# EAGLE design marc_rfid (EAGLE 5.06)
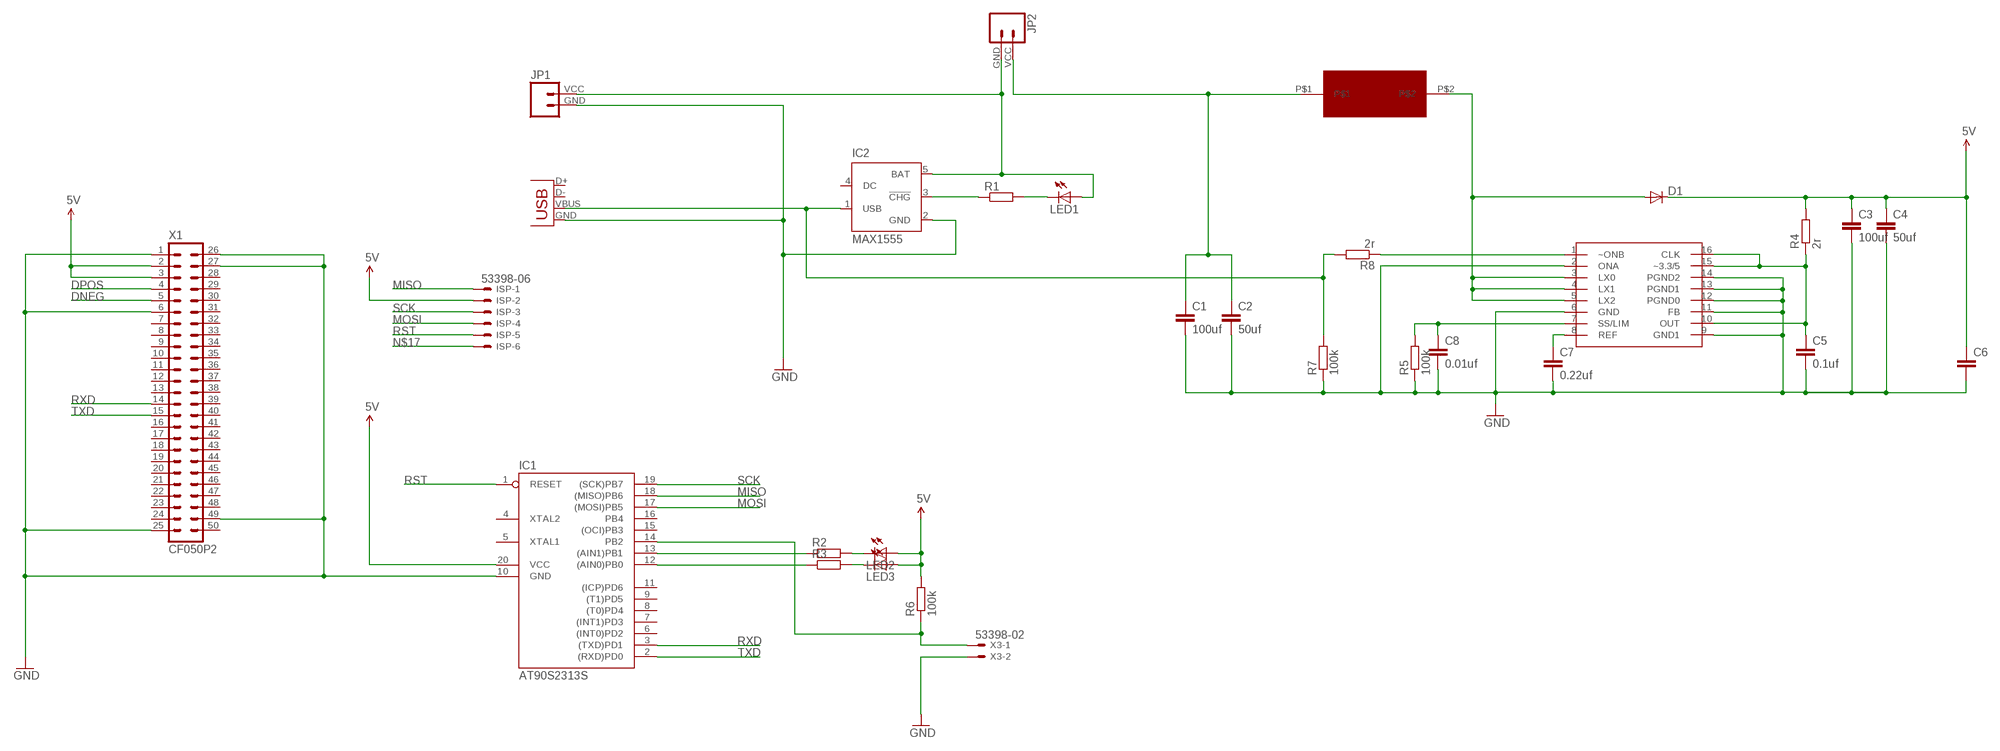
[diagram p0: schematic, sheet 1]

## Parts
C1  100uf  C-EUC1210  [C1210]
C2  50uf  C-EUC1210  [C1210]
C3  100uf  C-EUC1210  [C1210]
C4  50uf  C-EUC1210  [C1210]
C5  0.1uf  C-EUC0805  [C0805]
C6  C-EUC0805  [C0805]
C7  0.22uf  C-EUC0805  [C0805]
C8  0.01uf  C-EUC0805  [C0805]
D1  DIODE-DO214AC  [DO214AC]
IC1  AT90S2313S  [SO20L]
IC2  MAX1555  [SOT23-5L]
ISP  53398-06  [53398-06]
JP1  M024UCON-15767  [S2B-PH-VERTICAL]
JP2  M024UCON-15767  [S2B-PH-VERTICAL]
LED1  LED1206  [LED-1206]
LED2  LED1206  [LED-1206]
LED3  LED1206  [LED-1206]
R1  R-EU_R0805  [R0805]
R2  R-EU_R0805  [R0805]
R3  R-EU_R0805  [R0805]
R4  2r  R-EU_R0805W  [R0805W]
R5  100k  R-EU_R0805W  [R0805W]
R6  100k  R-EU_R0805W  [R0805W]
R7  100k  R-EU_R0805W  [R0805W]
R8  2r  R-EU_R0805W  [R0805W]
U$5  MAX1708  [QSOP16]
U$6  WE-TPC8015  [WE-TPC8015]
X1  CF050P2  [CF050P2]
X2  USBSMD  [USB-MINIB]
X3  53398-02  [53398-02]

## Nets
5V: C3.1 C4.1 C6.1 D1.C IC1.20(VCC) ISP.2 LED2.A LED3.A R4.2 R6.2 X1.2 X1.3
DNEG: X1.5
DPOS: X1.4
MISO: IC1.18((MISO)PB6) ISP.1
MOSI: IC1.17((MOSI)PB5) ISP.4
N$1: C1.1 C2.1 JP2.VCC U$6.P$1
N$2: IC1.13((AIN1)PB1) R2.1
N$3: IC2.1(USB) R7.2 R8.2 X2.VBUS
N$4: IC2.3(!CHG) R1.1
N$5: LED1.C R1.2
N$6: IC1.12((AIN0)PB0) R3.1
N$7: LED2.C R2.2
N$8: LED3.C R3.2
N$9: D1.A U$5.3(LX0) U$5.4(LX1) U$5.5(LX2) U$6.P$2
N$10: C7.1 U$5.8(REF)
N$11: C5.1 R4.1 U$5.10(OUT) U$5.15(~3.3/5) U$5.16(CLK)
N$12: C8.1 R5.2 U$5.7(SS/LIM)
N$14: R8.1 U$5.1(~ONB)
N$15: IC1.14(PB2) R6.1 X3.1
N$16: IC2.5(BAT) JP1.VCC JP2.GND LED1.A
N$17: C1.2 C2.2 C3.2 C4.2 C5.2 C6.2 C7.2 C8.2 IC1.10(GND) IC2.2(GND) ISP.6 JP1.GND R5.1 R7.1 U$5.2(ONA) U$5.6(GND) U$5.9(GND1) U$5.11(FB) U$5.12(PGND0) U$5.13(PGND1) U$5.14(PGND2) X1.1 X1.6 X1.25 X1.26 X1.27 X1.49 X2.GND X3.2 ; supply symbol labelled GND
RST: IC1.1(RESET) ISP.5
RXD: IC1.3((TXD)PD1) X1.14
SCK: IC1.19((SCK)PB7) ISP.3
TXD: IC1.2((RXD)PD0) X1.15
Unconnected: IC1.4(XTAL2) IC1.5(XTAL1) IC1.6((INT0)PD2) IC1.7((INT1)PD3) IC1.8((T0)PD4) IC1.9((T1)PD5) IC1.11((ICP)PD6) IC1.15((OCI)PB3) IC1.16(PB4) IC2.4(DC) X1.7 X1.8 X1.9 X1.10 X1.11 X1.12 X1.13 X1.16 X1.17 X1.18 X1.19 X1.20 X1.21 X1.22 X1.23 X1.24 X1.28 X1.29 X1.30 X1.31 X1.32 X1.33 X1.34 X1.35 X1.36 X1.37 X1.38 X1.39 X1.40 X1.41 X1.42 X1.43 X1.44 X1.45 X1.46 X1.47 X1.48 X1.50 X2.D+ X2.D-

## Library data of the parts
C1-C8 = resistor:C-EU: CAPACITOR, European symbol
D1 = diode:DIODE-: DIODE
IC1 = avr-4:AT90S2313: MICROCONTROLLER 2 Kbytes FLASH 128 bytes SRAM 128 bytes EEPROM UART
IC2 = maxim:MAX1555: Dual-Input USB/AC Adapter 1-Cell Li+ Battery Chargers Source: http://www.maxim-ic.com .. MAX1551-MAX1555.pdf
ISP = con-molex:53?-06: CONNECTOR wire to board 1.25 mm (.049 inch) pitch header
JP1 JP2 = SparkFun2:M02: Header 2 Standard 2-pin 0.1" header. Use with straight break away headers (SKU : PRT-00116), right angle break away headers (PRT-00553), swiss pins (PRT-00743), machine pins (PRT-00117), and female headers (PRT-00115). Molex polarized connector foot print use with SKU : PRT-08233 with associated crimp pins and housings.
LED1-LED3 = SparkFun:LED: LEDs Standard schematic elements and footprints for 5mm, 3mm, 1206, and 0603 sized LEDs. 5mm - Spark Fun Electronics SKU : COM-00529 (and others)
R1-R8 = resistor:R-EU_: RESISTOR, European symbol
U$5 = stan_1:MAX1708
U$6 = stan_1:WE-TPC8015
X1 = con-yamaichi-cf:CF050P2: Compact Flash Card Reader, Type I and II CF 050 P2 - * 03 - * 0 - DS
X2 = SparkFun:USB: USB Connectors USB-B-PTH is fully proven SKU : PRT-00139 USB-miniB is fully proven SKU : PRT-00587 USB-A-PCB is untested. USB-A-H is throughly reviewed, but untested. Spark Fun Electronics SKU : PRT-00437 USB-B-SMT is throughly reviewed, but untested. Needs silkscreen touching up. USB-A-S has not been used/tested USB-MB-H has not been used/tested
X3 = con-molex:53?-02: CONNECTOR wire to board 1.25 mm (.049 inch) pitch header

## Board
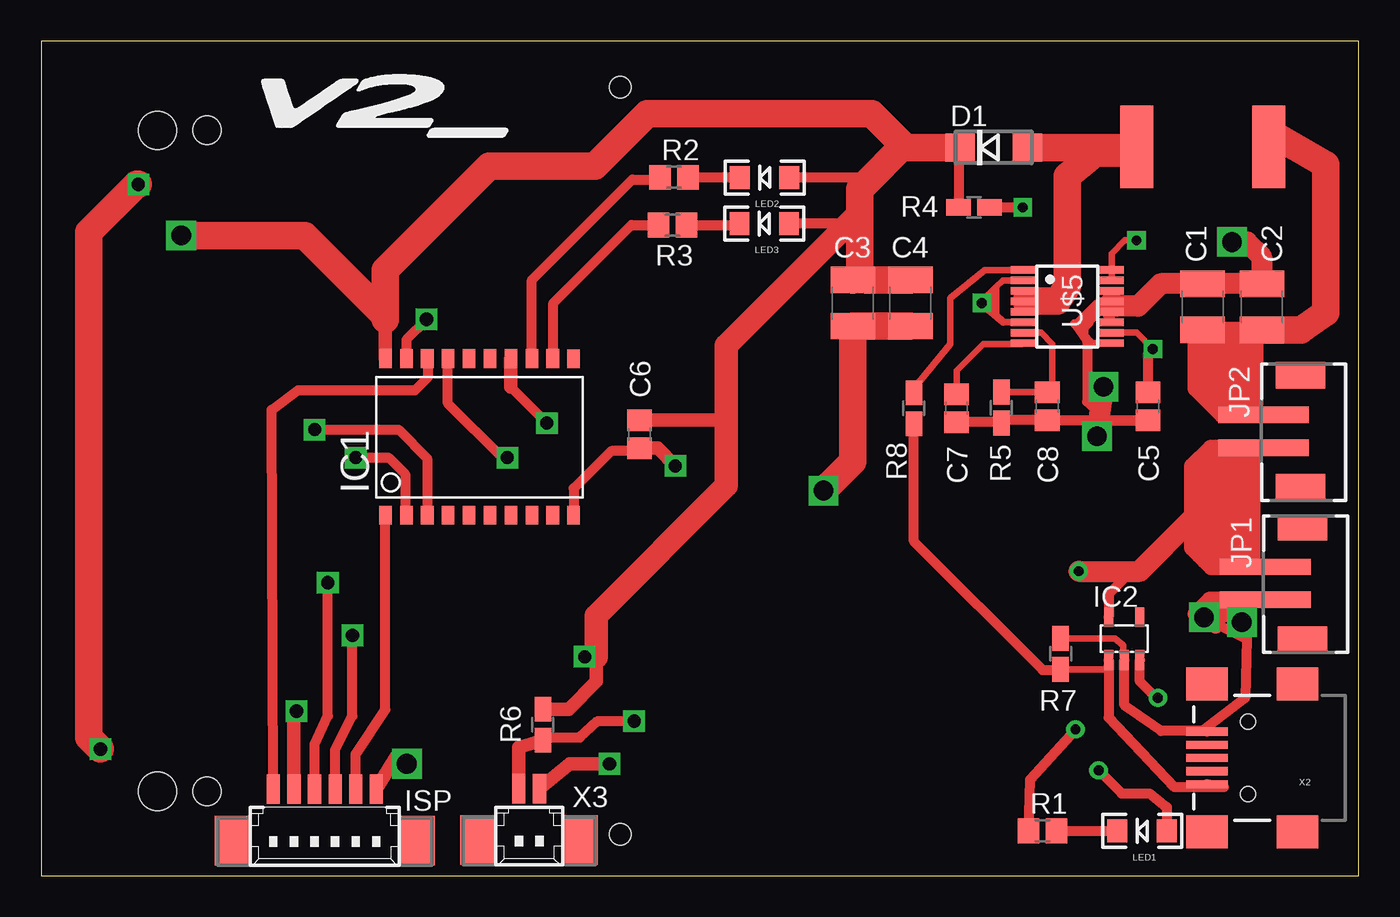
[diagram p1: board, top side]
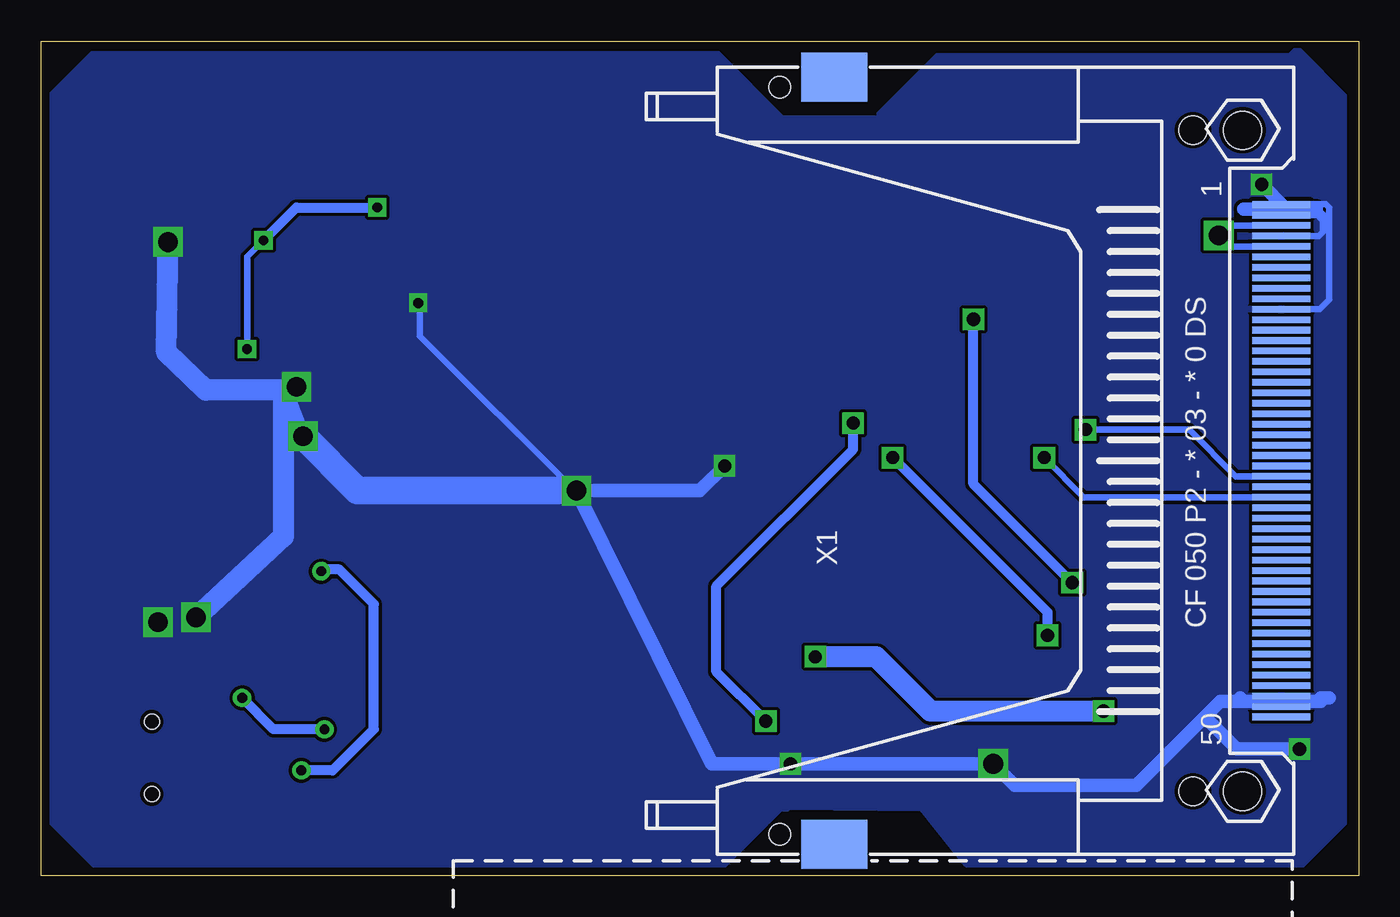
[diagram p2: board, bottom side, seen from below]

Size 80 x 50.7 mm. Coordinates in mm from the lower left corner, seen from the top.
Outline: 0,0 80,0 80,50.7 0,50.7 0,0
Copper layers (1*16): Top 0.035mm / dielectric 1.5mm / Bottom 0.035mm
Design rules "V2_stan *": minimum track width 8mil, minimum drill 20mil, track to track 8mil, track to pad 8mil, pad to pad 6mil, via to via 8mil, smd to smd 0mil, copper to edge 10mil, drill to drill 8mil, minimum pad ring 12mil, minimum via ring 10mil, stop-mask expansion 4mil, vias tented up to drill 25mil, thermal gap 10mil

### Footprints (pad centres in the part's own frame; a part is rotated, then mirrored left to right if it is on the bottom)
C1210 = smd 1.6 x 2.7: 1 -1.4,0; 2 1.4,0
C0805 = smd 1.3 x 1.5: 1 -0.85,0; 2 0.85,0
DO214AC = smd 1.8 x 1.7: A 2.05,0; C -2.05,0
SO20L = smd 0.762 x 1.143: 1 -5.08,-5.131; 2 -3.81,-5.131; 3 -2.54,-5.131; 4 -1.27,-5.131; 5 0,-5.131; 6 1.27,-5.131; 7 2.54,-5.131; 8 3.81,-5.131; 9 5.08,-5.131; 10 6.35,-5.131; 11 6.35,4.369; 12 5.08,4.394; 13 3.81,4.394; 14 2.54,4.394; 15 1.27,4.394; 16 0,4.394; 17 -1.27,4.394; 18 -2.54,4.394; 19 -3.81,4.394; 20 -5.08,4.394
SOT23-5L = smd 0.55 x 1.2: 1 -0.95,-1.3; 2 0,-1.3; 3 0.95,-1.3; 4 0.95,1.3; 5 -0.95,1.3
53398-06 = smd 0.8 x 1.8: 1 3.125,-2.5; 2 1.875,-2.5; 3 0.625,-2.5; 4 -0.625,-2.5; 5 -1.875,-2.5; 6 -3.125,-2.5 | smd 2.1 x 3: S1 5.625,0.625; S2 -5.625,0.625
S2B-PH-VERTICAL = smd 1 x 5.5: GND 1,-2; VCC -1,-2 | smd 1.6 x 3: P$1 -3.4,0.27; P$2 3.4,0.27
LED-1206 = smd 1.2 x 1.4: A -1.5,0; C 1.5,0
R0805 = smd 1.3 x 1.5: 1 -0.85,0; 2 0.85,0
R0805W = smd 1.5 x 1: 1 -0.94,0; 2 0.94,0
QSOP16 = smd 0.45 x 1.5: 1 -2.223,-2.69; 2 -1.587,-2.69; 3 -0.953,-2.69; 4 -0.318,-2.69; 5 0.318,-2.69; 6 0.953,-2.69; 7 1.587,-2.69; 8 2.223,-2.69; 9 2.223,2.69; 10 1.587,2.69; 11 0.953,2.69; 12 0.318,2.69; 13 -0.318,2.69; 14 -0.953,2.69; 15 -1.587,2.69; 16 -2.223,2.69
WE-TPC8015 = smd 5 x 2: P$1 0,-4; P$2 0,4
CF050P2 = smd 0.4 x 3.5: 1 15.557,-5.35; 2 14.287,-5.35; 3 13.018,-5.35; 4 11.748,-5.35; 5 10.477,-5.35; 6 9.207,-5.35; 7 7.938,-5.35; 8 6.668,-5.35; 9 5.397,-5.35; 10 4.128,-5.35; 11 2.857,-5.35; 12 1.587,-5.35; 13 0.318,-5.35; 14 -0.953,-5.35; 15 -2.223,-5.35; 16 -3.493,-5.35; 17 -4.763,-5.35; 18 -6.032,-5.35; 19 -7.303,-5.35; 20 -8.572,-5.35; 21 -9.842,-5.35; 22 -11.113,-5.35; 23 -12.383,-5.35; 24 -13.652,-5.35; 25 -14.922,-5.35; 26 14.922,-5.35; 27 13.652,-5.35; 28 12.383,-5.35; 29 11.113,-5.35; 30 9.842,-5.35; 31 8.572,-5.35; 32 7.303,-5.35; 33 6.032,-5.35; 34 4.763,-5.35; 35 3.493,-5.35; 36 2.223,-5.35; 37 0.953,-5.35; 38 -0.318,-5.35; 39 -1.587,-5.35; 40 -2.857,-5.35; 41 -4.128,-5.35; 42 -5.397,-5.35; 43 -6.668,-5.35; 44 -7.938,-5.35; 45 -9.207,-5.35; 46 -10.477,-5.35; 47 -11.748,-5.35; 48 -13.018,-5.35; 49 -14.287,-5.35; 50 -15.557,-5.35 | smd 3 x 4: P$1 23.3,21.8; P$3 -23.3,21.8 | hole 1.7: -20.08,0; 20.08,0 | hole 2.3: -20.08,-3; 20.08,-3 | hole 1.3: 22.7,25.1; -22.7,25.1
USB-MINIB = smd 2.5 x 0.5: D+ 2.5,0; D- 2.5,0.8; GND 2.5,-1.6; ID 2.5,-0.8; VBUS 2.5,1.6 | smd 2.5 x 2: GND@1 -3,-4.5; GND@2 -3,4.5; GND@3 2.5,4.5; GND@4 2.5,-4.5 | hole 0.9: 0,2.2; 0,-2.2
53398-02 = smd 0.8 x 1.8: 1 0.625,-2.5; 2 -0.625,-2.5 | smd 2.1 x 3: S1 3.125,0.625; S2 -3.125,0.625

### Placement (x,y rotation side)
C1  70.52,34.56 90 top
C2  74.12,34.56 90 top
C3  49.28,34.79 270 top
C4  52.78,34.79 270 top
C5  67.2,28.51 270 top
C6  36.33,26.82 270 top
C7  55.58,28.41 270 top
C8  61.08,28.53 270 top
D1  57.83,44.23 0 top
IC1  25.98,27.03 0 top
IC2  65.76,14.41 0 top
ISP  17.22,2.77 180 top
JP1  76.32,17.76 270 top
JP2  76.2,27 270 top
LED1  66.84,2.72 180 top
LED2  43.92,42.42 180 top
LED3  43.9,39.62 180 top
R1  60.8,2.73 0 top
R2  38.42,42.43 0 top
R3  38.34,39.53 0 top
R4  56.64,40.6 180 top
R5  58.3,28.44 90 top
R6  30.46,9.18 90 top
R7  61.89,13.48 270 top
R8  52.99,28.4 270 top
U$5  62.3,34.58 270 top
U$6  70.52,44.28 90 top
U$8  [V2_LOGO_L]  12.9,44.6 0 top
X1  10.06,25.21 90 bottom
X2  73.28,7.16 180 top
X3  29.63,2.79 180 top

### Tracks (layer width: path | path; a pad name or v marks a point on that pad's centre or on a via)
5V  (via drill 0.8, 1.2)
  Top 0.61: R4.2 55.7,44.15 D1.C | LED2.A 49.88,42.42 50.15,42.15 | LED3.A 49.62,39.62 49.7,39.7
  Top 0.813: C6.1 41.47,27.67 41.6,27.8 | R6.2 32.02,10.12 33.7,11.8 33.7,13.3 | ISP.2 15.35,10.24 v15.5,10 | 20.9,33.8 IC1.20
  Top 1.27: v33,13.3 33.7,13.3
  Top 1.422: 41.6,28.1 41.6,27.8 | 41.6,28.1 41.6,32.2 49.7,40.3 | 33.7,13.3 33.7,15.8 41.6,23.7 41.6,28.1
  Top 1.676: 52.5,44.23 52.23,44.23 50.15,42.15 49.7,41.7 49.7,40.3 49.7,39.7 49.7,36.61 | 52.5,44.23 D1.C | 49.7,36.61 C3.1 | C4.1 50.12,36.19 49.7,36.61 | 20.9,34 20.9,36.8 27.2,43.1 33.6,43.1 36.8,46.3 50.43,46.3 52.5,44.23 | 20.9,34 20.9,33.8 | v8.5,38.9 16,38.9 20.9,34
  Bottom 0.406: X1.3 7.83,38.23 v8.5,38.9 8.4,38.9 7.8,39.5 X1.2
  Bottom 1.27: v15.5,10 26,10 29.3,13.3 v33,13.3
MISO
  Top 0.61: ISP.1 13.99,28.3 15.6,29.5 22.7,29.5 23.5,30.3 23.5,31.36 IC1.18
MOSI  (via drill 0.8)
  Top 0.61: ISP.4 17.84,7.64 18.9,9.7 v18.9,14.6 | v28.3,25.4 28,25.4 24.7,28.7 IC1.17
  Bottom 0.61: v18.9,14.6 18.9,16 v28.3,25.4
N$1
  Top 1.016: JP2.VCC 71.7,28 70.1,29.6 70.1,32.6 70,32.7 73.6,32.7 73.7,32.6 73.7,28.7 73.4,28.4 72.4,28.4 70.7,30.1 70.7,32 72.8,32 72.9,31.9 72.9,29 72.8,28.9 72.8,29.2 71.4,30.6 71.4,31.4 71.2,31.6 72.1,31.6 72.3,31.4 72.3,30.3 72.2,30.2 72.2,31.48 C1.1 C2.1
  Top 1.676: C2.1 76.46,33.16 78,34.2 78,43.2 74.9,45 74.9,44.66 U$6.P$1
N$2
  Top 0.61: IC1.13 29.79,36.19 35.9,42.3 37.44,42.3 R2.1
N$3
  Top 0.406: R7.2 64.64,12.54 IC2.1
  Top 0.61: IC2.1 64.81,9.61 68.8,5.4 71.82,5.4 X2.VBUS | R8.2 52.99,20.31 60.8,12.5 61.85,12.5 R7.2
N$4  (via drill 0.6)
  Top 0.61: R1.1 60.05,5.85 v62.8,8.9 | v67.8,10.8 67.7,10.8 66.7,11.8 IC2.3
  Bottom 0.61: v62.8,8.9 65.9,8.9 v67.8,10.8
N$5
  Top 0.61: R1.2 63.83,2.73 LED1.C
N$6
  Top 0.61: R3.1 35.83,39.53 31.1,34.8 31.1,31.46 IC1.12
N$7
  Top 0.61: R2.2 LED2.C
N$8
  Top 0.61: R3.2 42.31,39.53 LED3.C
N$9
  Top 0.406: U$5.5 U$5.4 U$5.3 59.61,35.09 59.8,34.9
  Top 1.676: 59.8,34.9 61.7,34.9 62.3,35.8 62.3,42.5 64,43.9 66.14,43.9 U$6.P$2 66.47,44.23 D1.A
N$10
  Top 0.406: C7.1 55.58,30.68 57.2,32.3 59.55,32.3 U$5.8
N$11  (via drill 0.6)
  Top 0.406: U$5.15 U$5.16 65,36.81 65,37.8 65.8,38.6 v66.5,38.6 | U$5.10 66.51,32.99 v67.5,32
  Top 0.61: C5.1 67.2,31.7 v67.5,32 | v59.6,40.6 R4.1
  Bottom 0.406: v67.5,32 67.5,37.6 v66.5,38.6
  Bottom 0.61: v59.6,40.6 64.5,40.6 v66.5,38.6
N$12
  Top 0.406: R5.2 C8.1 61.4,29.7 61.4,32.3 60.71,32.99 U$5.7
N$13
  Top 0.406: 72.2,16.3 72.2,15.8 72.7,15.9
N$14
  Top 0.406: R8.1 52.99,29.59 55.2,32.3 55.2,35.1 57.3,36.8 U$5.1
N$15  (via drill 0.8)
  Top 0.61: v36,9.4 33.8,9.4 32.7,8.4 30.62,8.4 R6.1 | v30.7,27.5 28.52,29.68
  Top 0.813: X3.1 29,7.79 R6.1 | 28.52,29.68 IC1.14
  Bottom 0.61: v36,9.4 39,12.4 39,17.6 30.7,25.9 v30.7,27.5
N$16  (via drill 0.6)
  Top 0.61: IC2.5 64.81,17.11 68.5,20.8 69.9,20.8 | LED1.A 68.34,4.16 67.3,5 65.6,5 v64.2,6.4
  Top 1.016: JP1.VCC 71.04,18.76 70.65,19.15 | 70.65,19.15 70.3,19.5 73,19.5 73.2,19.3 73.4,19.1 | JP2.GND 71,26 69.9,24.9 69.9,21.7 69.9,20.8 69.9,19.9 70.65,19.15
  Top 1.27: v63,18.5 66.7,18.5 69.9,21.7
  Top 1.676: 71.2,19.8 71.1,19.8 71.1,25.1 72.1,25.1 | 72.1,25.1 72.1,25.4 | 72.1,25.1 72.1,19.9 73.2,19.9 73.2,19.3 73.2,25.5
  Bottom 0.61: v64.2,6.4 62.3,6.4 59.8,8.9 59.8,16.5 61.9,18.6 62.9,18.6 v63,18.5
N$17  (via drill 0.6, 0.8, 1.2)
  Top 0.305: 58.4,33.6 59.54,33.6 U$5.6 | v72.9,15.4 72.9,15.5 72.5,15.9
  Top 0.406: U$5.13 U$5.14 | U$5.9 63.84,32.36 63.4,32.8 63.4,33.4 63.6,33.6 | 64.66,34 U$5.11 U$5.12 U$5.13 | R7.1 65.18,14.42 65.7,14 65.7,13.07 IC2.2 | U$5.6 58.47,33.63 58,34.1 58,35.8 58.37,36.17 U$5.2 | 62.8,33.5 62.7,33.6 | U$5.13 64.8,34.9 64.6,34.7 | 58.4,33.6 57.1,34.7 57,34.8 57.9,35.7 57.9,34.3 57.8,34.2 57.8,34.3 57.3,34.8 57.4,34.8 57.7,35.1 57.7,34.7 57.2,34.7 v57.1,34.8 | C4.2 49.59,33.39 49.4,33.2 49.4,25.2 49.1,24.9 49,24.9 v47.5,23.4
  Top 0.61: IC2.2 65.76,10.36 68,8.8 70.5,8.8 | 70.5,8.8 70.54,8.8 X2.GND | 62.8,33.5 63.5,32.5 63.5,28.8 64.64,27.66 C5.2 61.1,27.66 C8.2 58.58,27.68 R5.1 58.24,27.56 C7.2 | 62.8,33.5 63.3,33.3 63.6,33.6 | 62.8,33.5 63.2,33.3 64.6,34.7 64.1,34.7 63,33.6 | 70.1,15.9 70.1,15.6 v70.6,15.7 73.2,14.4 73.1,10.8 70.5,8.8 | IC1.10 32.33,23.53 34.6,25.8 36.16,25.8 C6.2
  Top 0.813: C6.2 37.43,25.97 v38.5,24.9 | X3.2 32.09,6.79 v34.5,6.8 | v22.2,6.8 22.2,7 21.9,7.3 21.57,7.3 ISP.6
  Top 1.016: JP1.GND 70.96,16.76 70.1,15.9 72.5,15.9 73.2,16.6 71.8,16.6 71.3,15.2 v70.6,15.7
  Top 1.27: U$5.13 65.29,34.6 66.6,34.6 67.96,35.96 C1.2 C2.2 74.1,35.98 74.1,37.6 73.2,38.5 v72.3,38.5 | v64.1,26.7 v64.5,29.7
  Top 1.676: C4.2 C3.2 49.28,25.18 v47.5,23.4 | v5.9,42 5.8,42 2.9,39.1 2.9,8.4 v3.6,7.7
  Bottom 0.406: X1.1 X1.26 2.53,40.13 2.2,39.8 2.2,39.1 2.44,38.86 | X1.25 X1.49 4.71,10.89 5,10.6 | 2.44,38.86 X1.27 | 2.44,38.86 2,39.3 2,40 2.6,40.6 | X1.6 2.38,34.42 1.8,35 1.8,40.6 2,40.8 2.5,40.8 2.7,40.6 | v57.1,34.8 57.2,35 57,34.8 57,32.8 47.5,23.3 v47.5,23.4
  Bottom 0.813: 1.8,10.8 2.3,10.8 2.3,10.6 7.2,10.6 | v38.5,24.9 40,23.4 v47.5,23.4 39.3,6.8 v34.5,6.8 v22.2,6.8 20.9,5.5 13.5,5.5 9.35,9.65 | 7.2,10.6 5,10.6 | 9.35,9.65 8.4,10.6 7.2,10.6 | 2.6,40.6 2.7,40.6 4.5,40.6 v5.9,42 | v3.6,7.7 7.4,7.7 9.35,9.65 | 7.2,10.6 7.2,10.8
  Bottom 1.27: v70.6,15.7 65.3,20.6 65.3,29.3 v64.5,29.7 | v64.1,26.7 64.4,26.9 65.4,29.5 70,29.5 72.4,31.8 v72.3,38.5
  Bottom 1.676: v47.5,23.4 60.8,23.4 v64.1,26.7
  pour Bottom: 3.9,50.1 3.6,50.1 0.9,47.4 0.9,3.2 3.4,0.7 23.8,0.7 26.5,4.1 34.6,4.2 34.7,4.1 35.1,4.1 38.5,0.7 76.8,0.7 79.3,3.2 79.3,47.5 76.9,49.9 38.9,49.9 35,46 29.2,46 29.1,46.1 29.1,46.3 25.6,49.8 4.2,49.8
N$18
  Bottom 0.813: 2.6,40.5 7,40.5
RST
  Top 0.61: ISP.5 19.09,7.39 20.9,10.1 IC1.1
RXD  (via drill 0.8)
  Top 0.61: IC1.3 23.44,25.36 21.7,27.1 v16.6,27.1
  Bottom 0.406: v16.6,27.1 10.3,27.1 7.46,24.26 X1.14
SCK  (via drill 0.8)
  Top 0.61: ISP.3 16.59,8 17.4,9.7 v17.4,17.8 | IC1.19 22.17,32.57 v23.4,33.8
  Bottom 0.61: v23.4,33.8 23.4,23.8 v17.4,17.8
TXD  (via drill 0.8)
  Top 0.61: v19.1,25.4 21.1,25.4 22.1,24.4 22.1,21.97 IC1.2
  Bottom 0.406: X1.15 16.69,22.99 v19.1,25.4